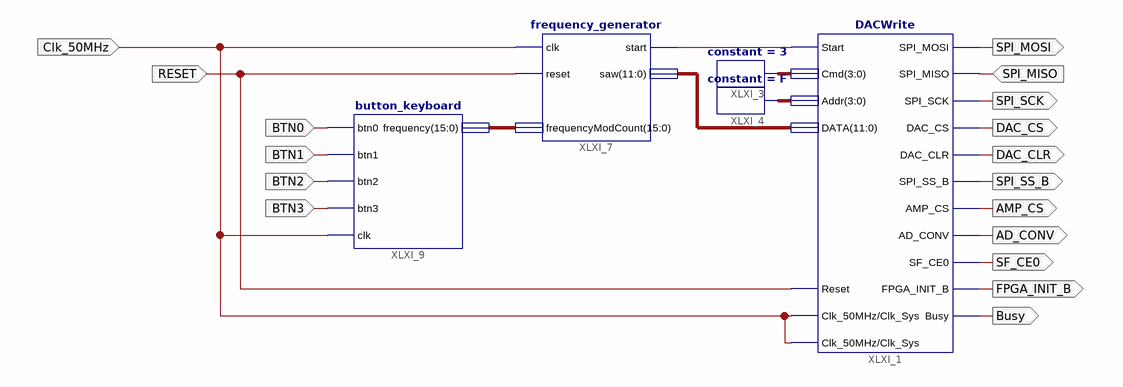
[diagram p0: schematic sheet 1]
// Xilinx ISE schematic main_schematic.sch (spartan3e) as structural Verilog: 5 symbols, 17 ports
module main_schematic (
  input  SPI_MISO,
  input  Clk_50MHz,
  input  RESET,
  input  BTN0,
  input  BTN1,
  input  BTN2,
  input  BTN3,
  output SPI_MOSI,
  output SPI_SCK,
  output DAC_CS,
  output DAC_CLR,
  output SPI_SS_B,
  output AMP_CS,
  output AD_CONV,
  output SF_CE0,
  output FPGA_INIT_B,
  output Busy
);

  wire XLXN_1;
  wire [3:0] XLXN_4, XLXN_5;
  wire [11:0] XLXN_3;
  wire [15:0] XLXN_31;

  DACWrite XLXI_1 (
    .Reset(RESET), .Start(XLXN_1), .SPI_MISO(SPI_MISO), .Cmd(XLXN_4), .Addr(XLXN_5), .DATA(XLXN_3),
    .DAC_CLR(DAC_CLR), .DAC_CS(DAC_CS), .SPI_MOSI(SPI_MOSI), .SPI_SCK(SPI_SCK), .SPI_SS_B(SPI_SS_B),
    .AMP_CS(AMP_CS), .AD_CONV(AD_CONV), .SF_CE0(SF_CE0), .FPGA_INIT_B(FPGA_INIT_B), .Busy(Busy),
    .Clk_50MHz(Clk_50MHz), .Clk_Sys(Clk_50MHz));
  constant #(.CValue("3")) XLXI_3 (.O(XLXN_4));
  constant #(.CValue("F")) XLXI_4 (.O(XLXN_5));
  frequency_generator XLXI_7 (
    .clk(Clk_50MHz), .reset(RESET), .frequencyModCount(XLXN_31), .start(XLXN_1), .saw(XLXN_3));
  button_keyboard XLXI_9 (.clk(Clk_50MHz), .btn0(BTN0), .btn1(BTN1), .btn2(BTN2), .btn3(BTN3), .frequency(XLXN_31));
endmodule
